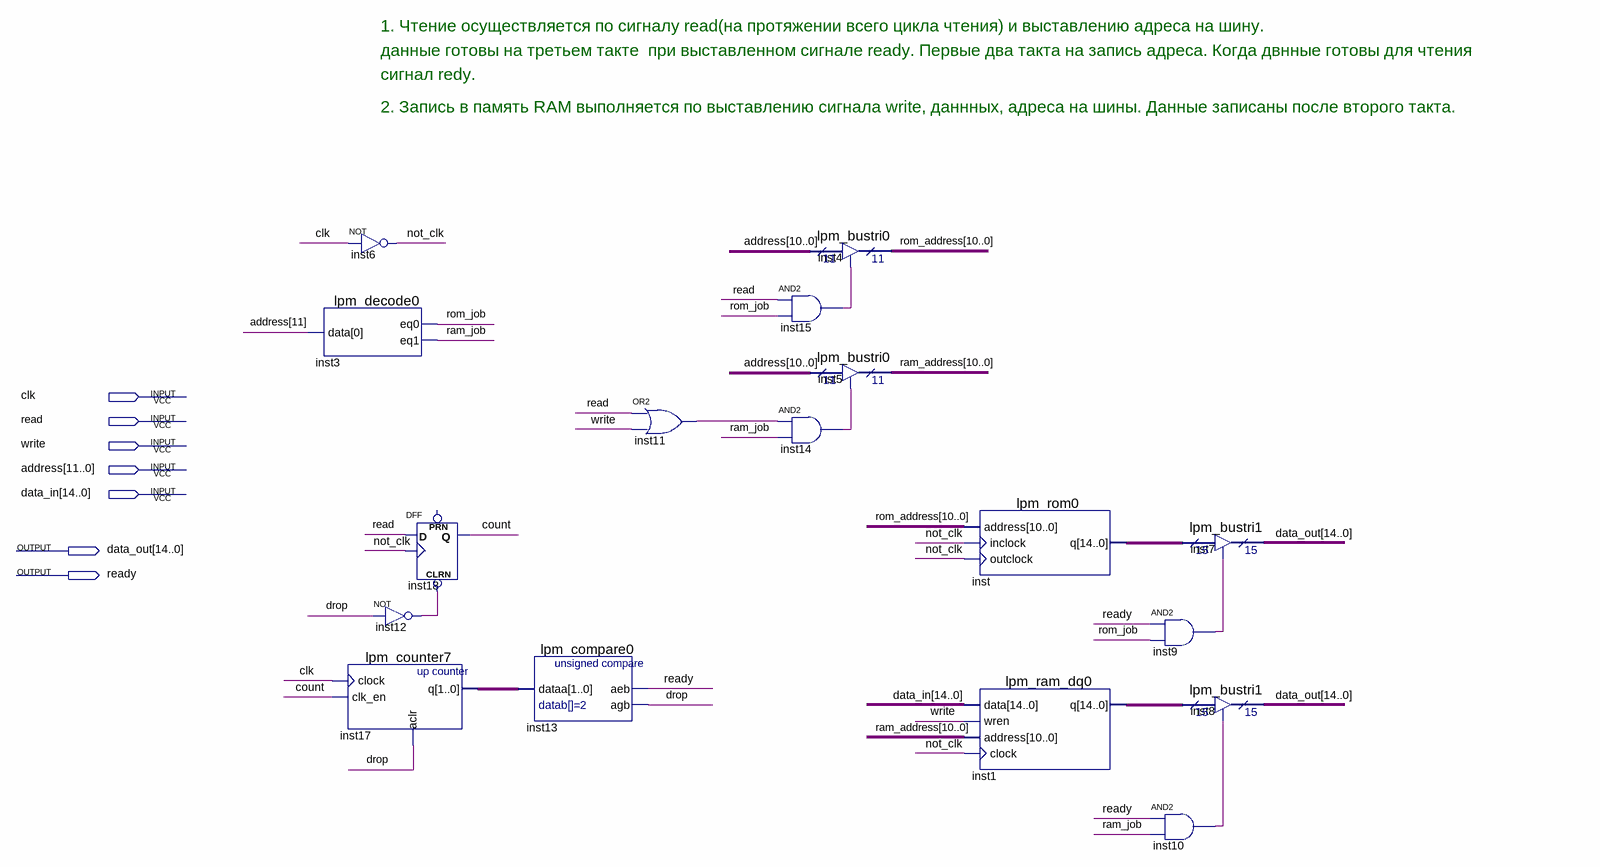
[diagram p0: schematic sheet]
// Quartus schematic memory.bdf as structural Verilog: 17 symbols, 7 pins
module memory (
  input  clk,
  input  read,
  input  write,
  input  [11:0] address,
  input  [14:0] data_in,
  output [14:0] data_out,
  output ready
);

  wire count, drop, inst9_out, inst10_out, inst11_out, inst12_out, inst14_out, inst15_out, not_clk, ram_job,
       rom_job;
  wire [1:0] inst17_q;
  wire [10:0] ram_address, rom_address;
  wire [14:0] inst1_q, inst_q;

  lpm_decode0 inst3 (.data(address[11]), .eq0(rom_job), .eq1(ram_job));
  lpm_counter7 inst17 (.clock(clk), .clk_en(count), .aclr(drop), .q(inst17_q));
  not inst6 (not_clk, clk);
  DFF inst18 (.CLRN(inst12_out), .CLK(not_clk), .D(read), .Q(count));  // open: PRN
  not inst12 (inst12_out, drop);
  lpm_compare0 inst13 (.dataa(inst17_q), .aeb(ready), .agb(drop));
  or inst11 (inst11_out, read, write);
  and inst15 (inst15_out, read, rom_job);
  and inst14 (inst14_out, inst11_out, ram_job);
  lpm_bustri0 inst4 (.enabledt(inst15_out), .data(address[10:0]), .tridata(rom_address));
  lpm_bustri0 inst5 (.enabledt(inst14_out), .data(address[10:0]), .tridata(ram_address));
  lpm_rom0 inst (.address(rom_address), .inclock(not_clk), .outclock(not_clk), .q(inst_q));
  lpm_ram_dq0 inst1 (.data(data_in), .wren(write), .address(ram_address), .clock(not_clk), .q(inst1_q));
  lpm_bustri1 inst7 (.enabledt(inst9_out), .data(inst_q), .tridata(data_out));
  and inst9 (inst9_out, ready, rom_job);
  lpm_bustri1 inst8 (.enabledt(inst10_out), .data(inst1_q), .tridata(data_out));
  and inst10 (inst10_out, ready, ram_job);

  // Notes on the sheet:
  //   1. Чтение осуществляется по сигналу read(на протяжении всего цикла чтения) и выставлению адреса на шину.
  //   данные готовы на третьем такте  при выставленном сигнале ready. Первые два такта на запись адреса. Когда двнные готовы для чтения
  //   сигнал redy.
  //   2. Запись в память RAM выполняется по выставлению сигнала write, даннных, адреса на шины. Данные записаны после второго такта.
endmodule
